# EAGLE design W023 (EAGLE 6.6.0)
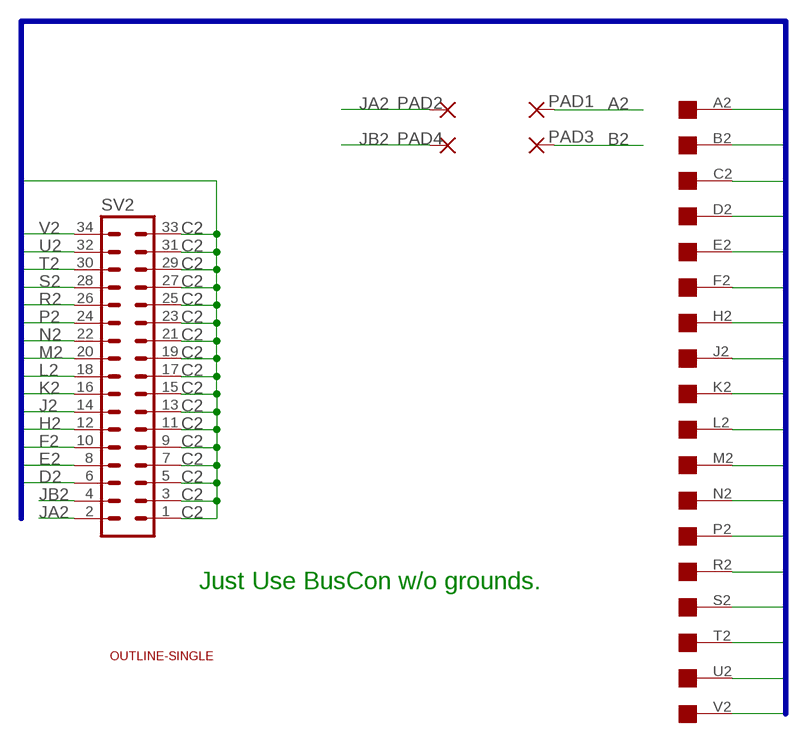
[diagram p0: schematic, sheet 1]

## Parts
PAD1  1,6/0,8  [1,6/0,8]
PAD2  1,6/0,8  [1,6/0,8]
PAD3  1,6/0,8  [1,6/0,8]
PAD4  1,6/0,8  [1,6/0,8]
SV2  MA17-2  [MA17-2]
U$1  EDGE-1  [EDGE-CON1]
U$2  OUTLINE-SINGLE  [SINGLE]

## Nets
A2: PAD1.1(P) U$1.A2
B2: PAD3.1(P) U$1.B2
C2: SV2.1 SV2.3 SV2.5 SV2.7 SV2.9 SV2.11 SV2.13 SV2.15 SV2.17 SV2.19 SV2.21 SV2.23 SV2.25 SV2.27 SV2.29 SV2.31 SV2.33 U$1.C2
D2: SV2.6 U$1.D2
E2: SV2.8 U$1.E2
F2: SV2.10 U$1.F2
H2: SV2.12 U$1.H2
J2: SV2.14 U$1.J2
JA2: PAD2.1(P) SV2.2
JB2: PAD4.1(P) SV2.4
K2: SV2.16 U$1.K2
L2: SV2.18 U$1.L2
M2: SV2.20 U$1.M2
N2: SV2.22 U$1.N2
P2: SV2.24 U$1.P2
R2: SV2.26 U$1.R2
S2: SV2.28 U$1.S2
T2: SV2.30 U$1.T2
U2: SV2.32 U$1.U2
V2: SV2.34 U$1.V2

## Buses
A2,B2,C2,D2,E2,F2,H2,J2,K2,L2,M2,N2,P2,R2,S2,T2,U2,V2

## Notes on the sheet
- Just Use BusCon w/o grounds.

## Library data of the parts
PAD1-PAD4 = wirepad:1,6/0,8: THROUGH-HOLE PAD
SV2 = con-lstb:MA17-2: PIN HEADER; OC_FARNELL: unknown; OC_NEWARK: unknown
U$1 = dec-con:EDGE-1: Single-Sided DEC Edge Connector -- (side 2)
U$2 = dec-con:OUTLINE-*: Board outlines for DEC boards.

## Board
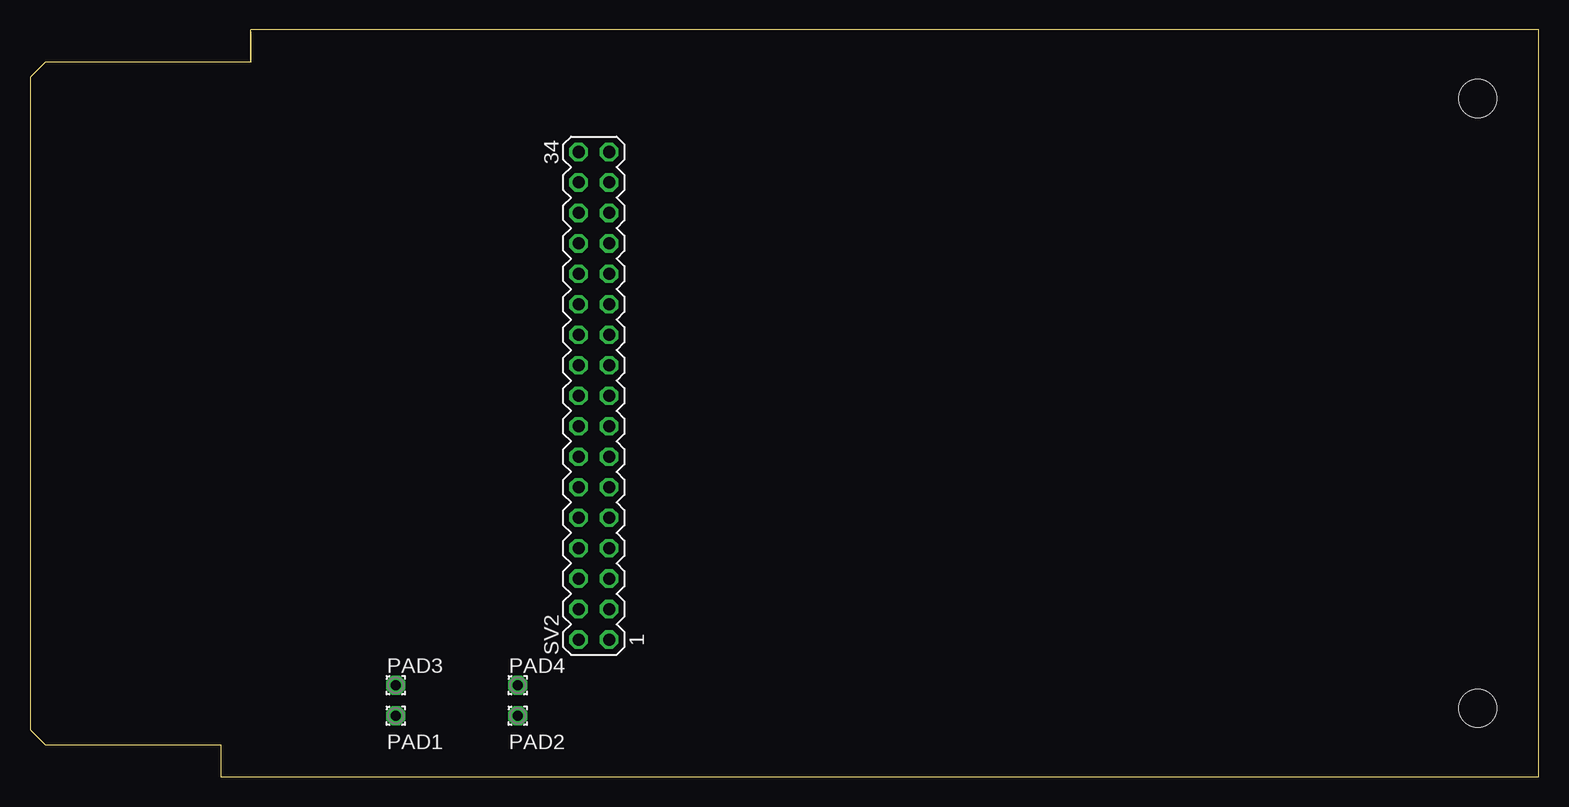
[diagram p1: board, top side]
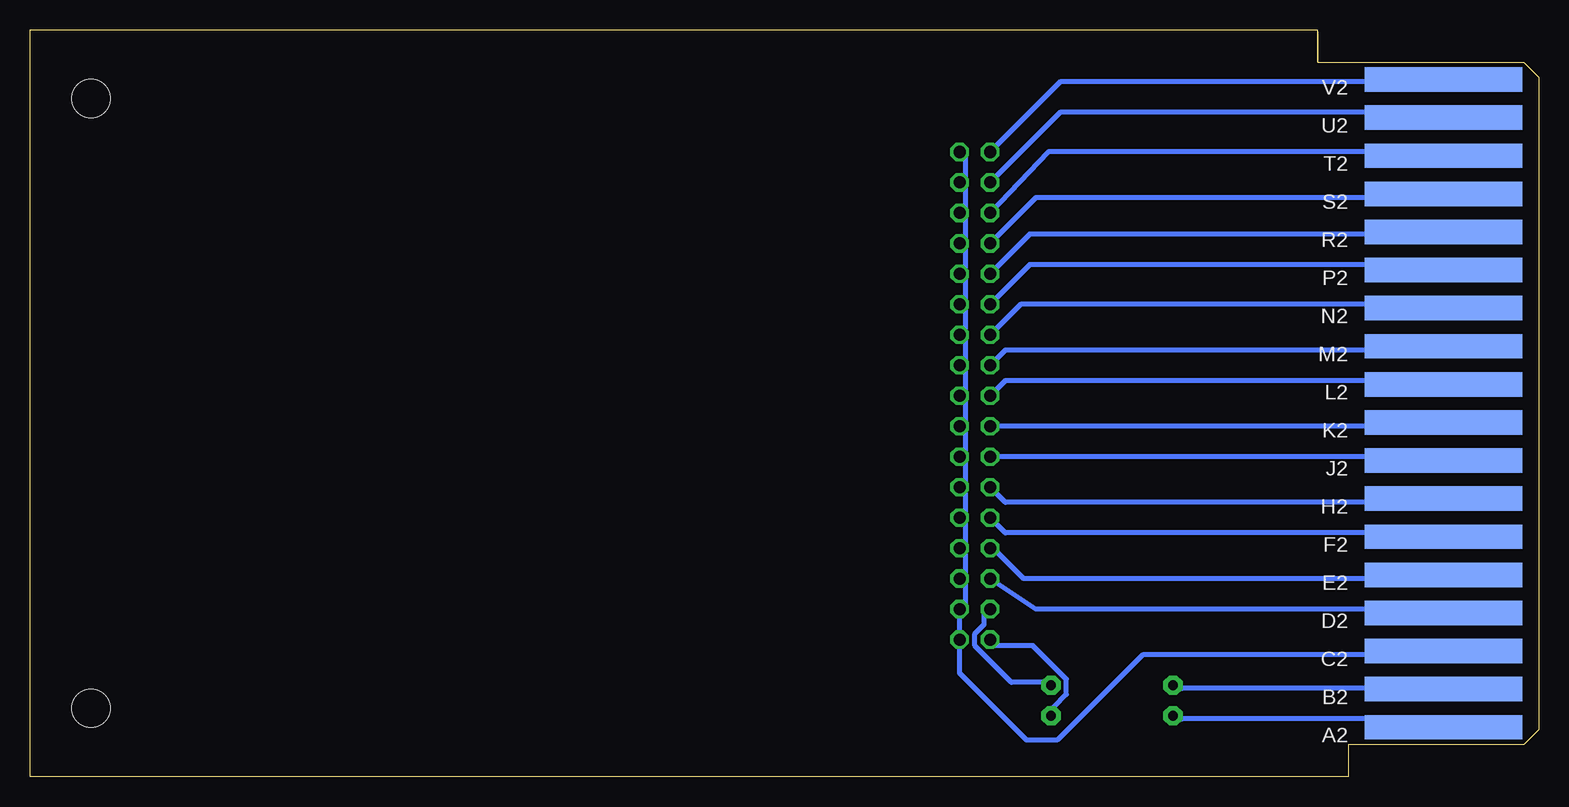
[diagram p2: board, bottom side, seen from below]

Size 125.73 x 62.23 mm. Coordinates in mm from the lower left corner, seen from the top.
Copper layers (1+16): Top 0.035mm / dielectric 1.5mm / Bottom 0.035mm
Design rules "16mils": minimum track width 16mil, minimum drill 32mil, track to track 15mil, track to pad 10mil, pad to pad 10mil, via to via 10mil, smd to smd 10mil, copper to edge 13mil, drill to drill 10mil, minimum pad ring 10mil, minimum via ring 8mil, stop-mask expansion 0mil, vias tented up to drill 0mil, thermal gap 10mil

### Footprints (pad centres in the part's own frame; a part is rotated, then mirrored left to right if it is on the bottom)
1,6/0,8 = drill 0.813 pad 1.6 octagon: 1 0,0
MA17-2 = drill 1.016 octagon: 1 -20.32,-1.27; 2 -20.32,1.27; 3 -17.78,-1.27; 4 -17.78,1.27; 5 -15.24,-1.27; 6 -15.24,1.27; 7 -12.7,-1.27; 8 -12.7,1.27; 9 -10.16,-1.27; 10 -10.16,1.27; 11 -7.62,-1.27; 12 -7.62,1.27; 13 -5.08,-1.27; 14 -5.08,1.27; 15 -2.54,-1.27; 16 -2.54,1.27; 17 0,-1.27; 18 0,1.27; 19 2.54,-1.27; 20 2.54,1.27; 21 5.08,-1.27; 22 5.08,1.27; 23 7.62,-1.27; 24 7.62,1.27; 25 10.16,-1.27; 26 10.16,1.27; 27 12.7,-1.27; 28 12.7,1.27; 29 15.24,-1.27; 30 15.24,1.27; 31 17.78,-1.27; 32 17.78,1.27; 33 20.32,-1.27; 34 20.32,1.27
EDGE-CON1 = smd 13.106 x 2.032 bottom: A2 7.938,4.128; B2 7.938,7.303; C2 7.938,10.477; D2 7.938,13.652; E2 7.938,16.828; F2 7.938,20.003; H2 7.938,23.177; J2 7.938,26.352; K2 7.938,29.527; L2 7.938,32.703; M2 7.938,35.877; N2 7.938,39.053; P2 7.938,42.227; R2 7.938,45.403; S2 7.938,48.578; T2 7.938,51.752; U2 7.938,54.928; V2 7.938,58.102
SINGLE = hole 3.175: 120.65,56.515; 120.65,5.715

### Placement (x,y rotation side)
PAD1  30.48,5.08 0 top
PAD2  40.64,5.08 0 top
PAD3  30.48,7.62 0 top
PAD4  40.64,7.62 0 top
SV2  46.99,31.75 90 top
U$1  0,0 0 top
U$2  0,0 0 top

### Tracks (layer width: path | path; a pad name or v marks a point on that pad's centre or on a via)
A2
  Bottom 0.406: PAD1.1 29.72,4.83 13.97,4.83 U$1.A2
B2
  Bottom 0.406: PAD3.1 29.72,7.37 13.97,7.37 U$1.B2
C2
  Bottom 0.406: SV2.33 47.75,51.56 47.75,50.04 SV2.31 47.75,49.02 47.75,47.5 SV2.29 47.75,46.48 47.75,44.96 SV2.27 47.75,43.94 47.75,42.42 SV2.25 47.75,41.4 47.75,39.88 SV2.23 47.75,38.86 47.75,37.34 SV2.21 47.75,36.32 47.75,34.8 SV2.19 47.75,33.78 47.75,32.26 SV2.17 47.75,31.24 47.75,29.72 SV2.15 47.75,28.7 47.75,27.18 SV2.13 47.75,26.16 47.75,24.64 SV2.11 47.75,23.62 47.75,22.1 SV2.9 47.75,21.08 47.75,19.56 SV2.7 47.75,18.54 47.75,17.02 SV2.5 47.75,16 47.75,14.48 SV2.3 SV2.1 48.26,8.64 42.67,3.05 40.13,3.05 33.02,10.16 13.72,10.16 U$1.C2
D2
  Bottom 0.406: SV2.6 41.91,13.97 12.57,13.97 U$1.D2
E2
  Bottom 0.406: SV2.8 45.21,18.8 42.93,16.51 12.7,16.51 U$1.E2
F2
  Bottom 0.406: SV2.10 44.45,20.32 13.46,20.32 U$1.F2
H2
  Bottom 0.406: SV2.12 44.45,22.86 13.46,22.86 U$1.H2
J2
  Bottom 0.406: SV2.14 12.45,26.67 U$1.J2
JA2
  Bottom 0.406: SV2.2 45.21,10.92 42.16,10.92 39.37,8.13 39.37,6.86 40.39,5.84 PAD2.1
JB2
  Bottom 0.406: SV2.4 46.23,13.46 46.23,12.7 46.99,11.94 46.99,10.92 43.94,7.87 41.4,7.87 PAD4.1
K2
  Bottom 0.406: SV2.16 13.46,29.21 U$1.K2
L2
  Bottom 0.406: SV2.18 44.45,33.02 43.18,33.02 13.46,33.02 U$1.L2
M2
  Bottom 0.406: SV2.20 44.45,35.56 43.94,35.56 12.95,35.56 U$1.M2
N2
  Bottom 0.406: SV2.22 43.18,39.37 13.97,39.37 U$1.N2
P2
  Bottom 0.406: SV2.24 42.42,42.67 13.97,42.67 U$1.P2
R2
  Bottom 0.406: SV2.26 42.42,45.21 13.97,45.21 U$1.R2
S2
  Bottom 0.406: SV2.28 41.91,48.26 13.46,48.26 U$1.S2
T2
  Bottom 0.406: SV2.30 40.89,52.07 13.97,52.07 U$1.T2
U2
  Bottom 0.406: SV2.32 39.88,55.37 13.97,55.37 U$1.U2
V2
  Bottom 0.406: SV2.34 39.88,57.91 13.97,57.91 U$1.V2